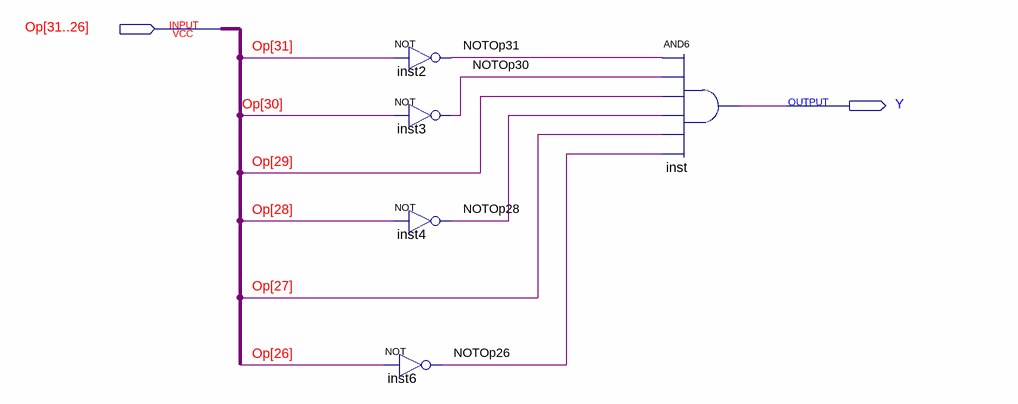
[diagram p0: schematic sheet]
// Quartus schematic SLTI.bdf as structural Verilog: 5 symbols, 2 pins
module SLTI (
  input  [31:26] Op,
  output Y
);

  wire NOTOp26, NOTOp28, NOTOp30, NOTOp31;

  not inst2 (NOTOp31, Op[31]);
  not inst3 (NOTOp30, Op[30]);
  not inst4 (NOTOp28, Op[28]);
  not inst6 (NOTOp26, Op[26]);
  and inst (Y, NOTOp31, NOTOp30, Op[29], NOTOp28, Op[27], NOTOp26);
endmodule
